# EAGLE schematic TPS613222A (EAGLE 9.0.0)
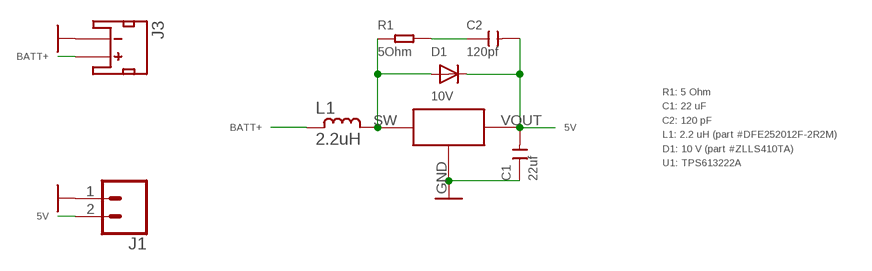
[diagram p0: schematic, sheet 1]

## Parts
C1  22uf  CERAMIC-22UF-6.3V-20%-X5R(0805)  [C0805]
C2  120pf  CERAMIC-22UF-6.3V-20%-X5R(0805)  [C0805]
D1  10V  DIODESOD-323F  [SOD-323F]
J1  CONN_02PTH4  [1X02_XTRA_BIG]
J3  Batt Conn  JST_2MM_MALE  [JST-2-SMD]
L1  2.2uH  L-1008CS  [L1008CS]
R1  5Ohm  SMD-RES-0.1R-5%-1/8W(0805)  [R0805]
U1  TPS613222A  [TPS613222A]

## Nets
5V: C1.2 C2.2 D1.C J1.2 U1.VOUT
BATT+: J3.2(+) L1.1
GND: C1.1 J1.1 J3.1(-) U1.GND
N$1: D1.A L1.2 R1.1 U1.SW
N$2: C2.1 R1.2
Unconnected: J3.NC1(PAD1) J3.NC2(PAD2)

## Notes on the sheet
- R1: 5 Ohm
  C1: 22 uF
  C2: 120 pF
  L1: 2.2 uH (part #DFE252012F-2R2M)
  D1: 10 V (part #ZLLS410TA)
  U1: TPS613222A

## Library data of the parts
C1 = Seeed-Capacitor:CERAMIC-22UF-6.3V-20%-X5R(0805): 302010171; MPN: CC0805MKX5R5BB226
C2 = Seeed-Capacitor:CERAMIC-22UF-6.3V-20%-X5R(0805): 302010171; MPN: CC0805MKX5R5BB226; VALUE: 22uf
D1 = adafruit:DIODE: Diode SMADIODE - SMA Surface Mount Package 20V 1A Schottky Diode Digikey: 641-1014-6-ND DO-1N4148 - Through Hole Small Current Diode SOD-123 20V 1 A (.5mV Vf) Schottky Diode - Digikey: MBRX120TPMSCT-ND SOD-323 10V 570mA (.38mV Vf, 3ns) Schottky Diode - Digikey: ZLLS410CT-ND SOD-523 30V 30mA Schottky Diode (RB751S-40TE61) - Digikey: RB751S-40TE61CT-ND SOT23-R/W - SOT23 Package (R = Solder Paste/Reflow Ovens, W = Hand-Soldering) BAT54Film 40V 300mA - Digikey: 497-7162-1-ND
J1 = SparkFun-Connectors:CONN_02: Multi connection point. Often used as Generic Header-pin footprint for 0.1 inch spaced/style header connections On any of the 0.1 inch spaced packages, you can populate with these: Break Away Headers - Straight <https://www.sparkfun.com/products/116> (PRT-00116) Break Away Male Headers - Right Angle <https://www.sparkfun.com/products/553> (PRT-00553) Female Headers <https://www.sparkfun.com/products/115> (PRT-00115) Break Away Headers - Machine Pin <https://www.sparkfun.com/products/117> (PRT-00117) Break Away Female Headers - Swiss Machine Pin <https://www.sparkfun.com/products/743> (PRT-00743) For SCREWTERMINALS and SPRING TERMINALS visit here: Screw Terimnals on SparkFun.com <https://www.sparkfun.com/search/results?term=Screw+Terminals> (5mm/3.5mm/2.54mm spacing) This device is also useful as a general connection point to wire up your design to another part of your project. Our various solder wires solder well into these plated through hole pads. Hook-Up Wire - Assortment (Stranded, 22 AWG) <https://www.sparkfun.com/products/11375> (PRT-11375) Hook-Up Wire - Assortment (Solid Core, 22 AWG) <https://www.sparkfun.com/products/11367> (PRT-11367) View the entire wire category on our website here <https://www.sparkfun.com/categories/141> Special notes: Molex polarized connector foot print use with: PRT-08233 with associated crimp pins and housings. 2.54_SCREWTERM for use with PRT-10571. 3.5mm Screw Terminal footprints for PRT-08084 5mm Screw Terminal footprints for use with PRT-08432
J3 = SparkFun-Connectors:JST_2MM_MALE: Mates to single-cell LiPo batteries. CONN-11443 Now with smashable polarity marks!; BTM_NEG: -; BTM_POS: +; PROD_ID: CONN-11443; TOP_NEG: -; TOP_POS: +
L1 = inductor-coilcraft:L-: SMD INDUCTOR
R1 = Seeed-Resistor:SMD-RES-0.1R-5%-1/8W(0805): 301010264; MPN: RL0805JR-070R1L; VALUE: 0.1R
U1 = 32teeth - TPS613222A:TPS613222A